# EAGLE board CFT-PB1-revB (EAGLE 5.11)
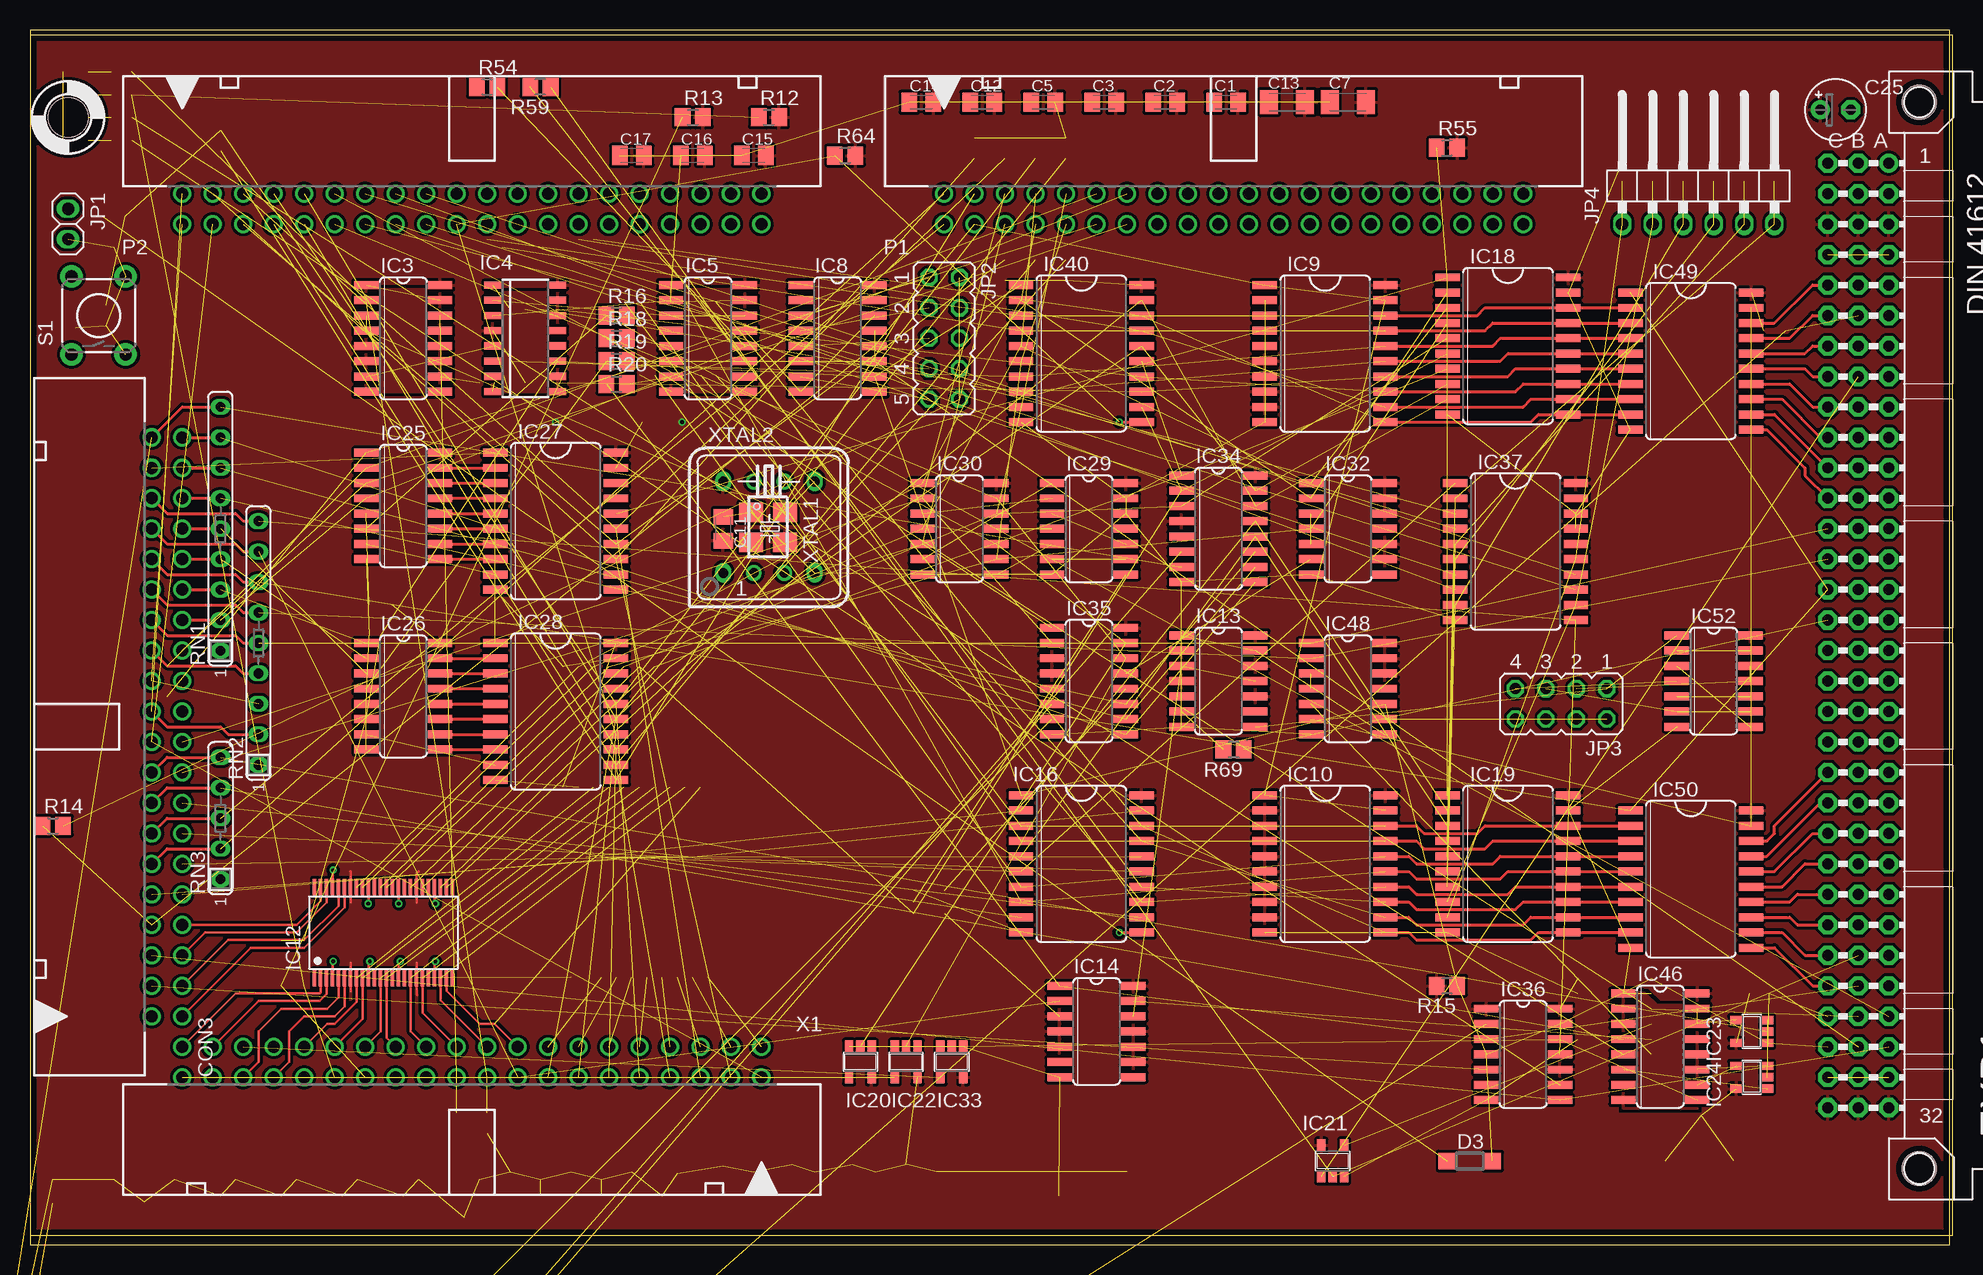
[diagram p11: board, top side]
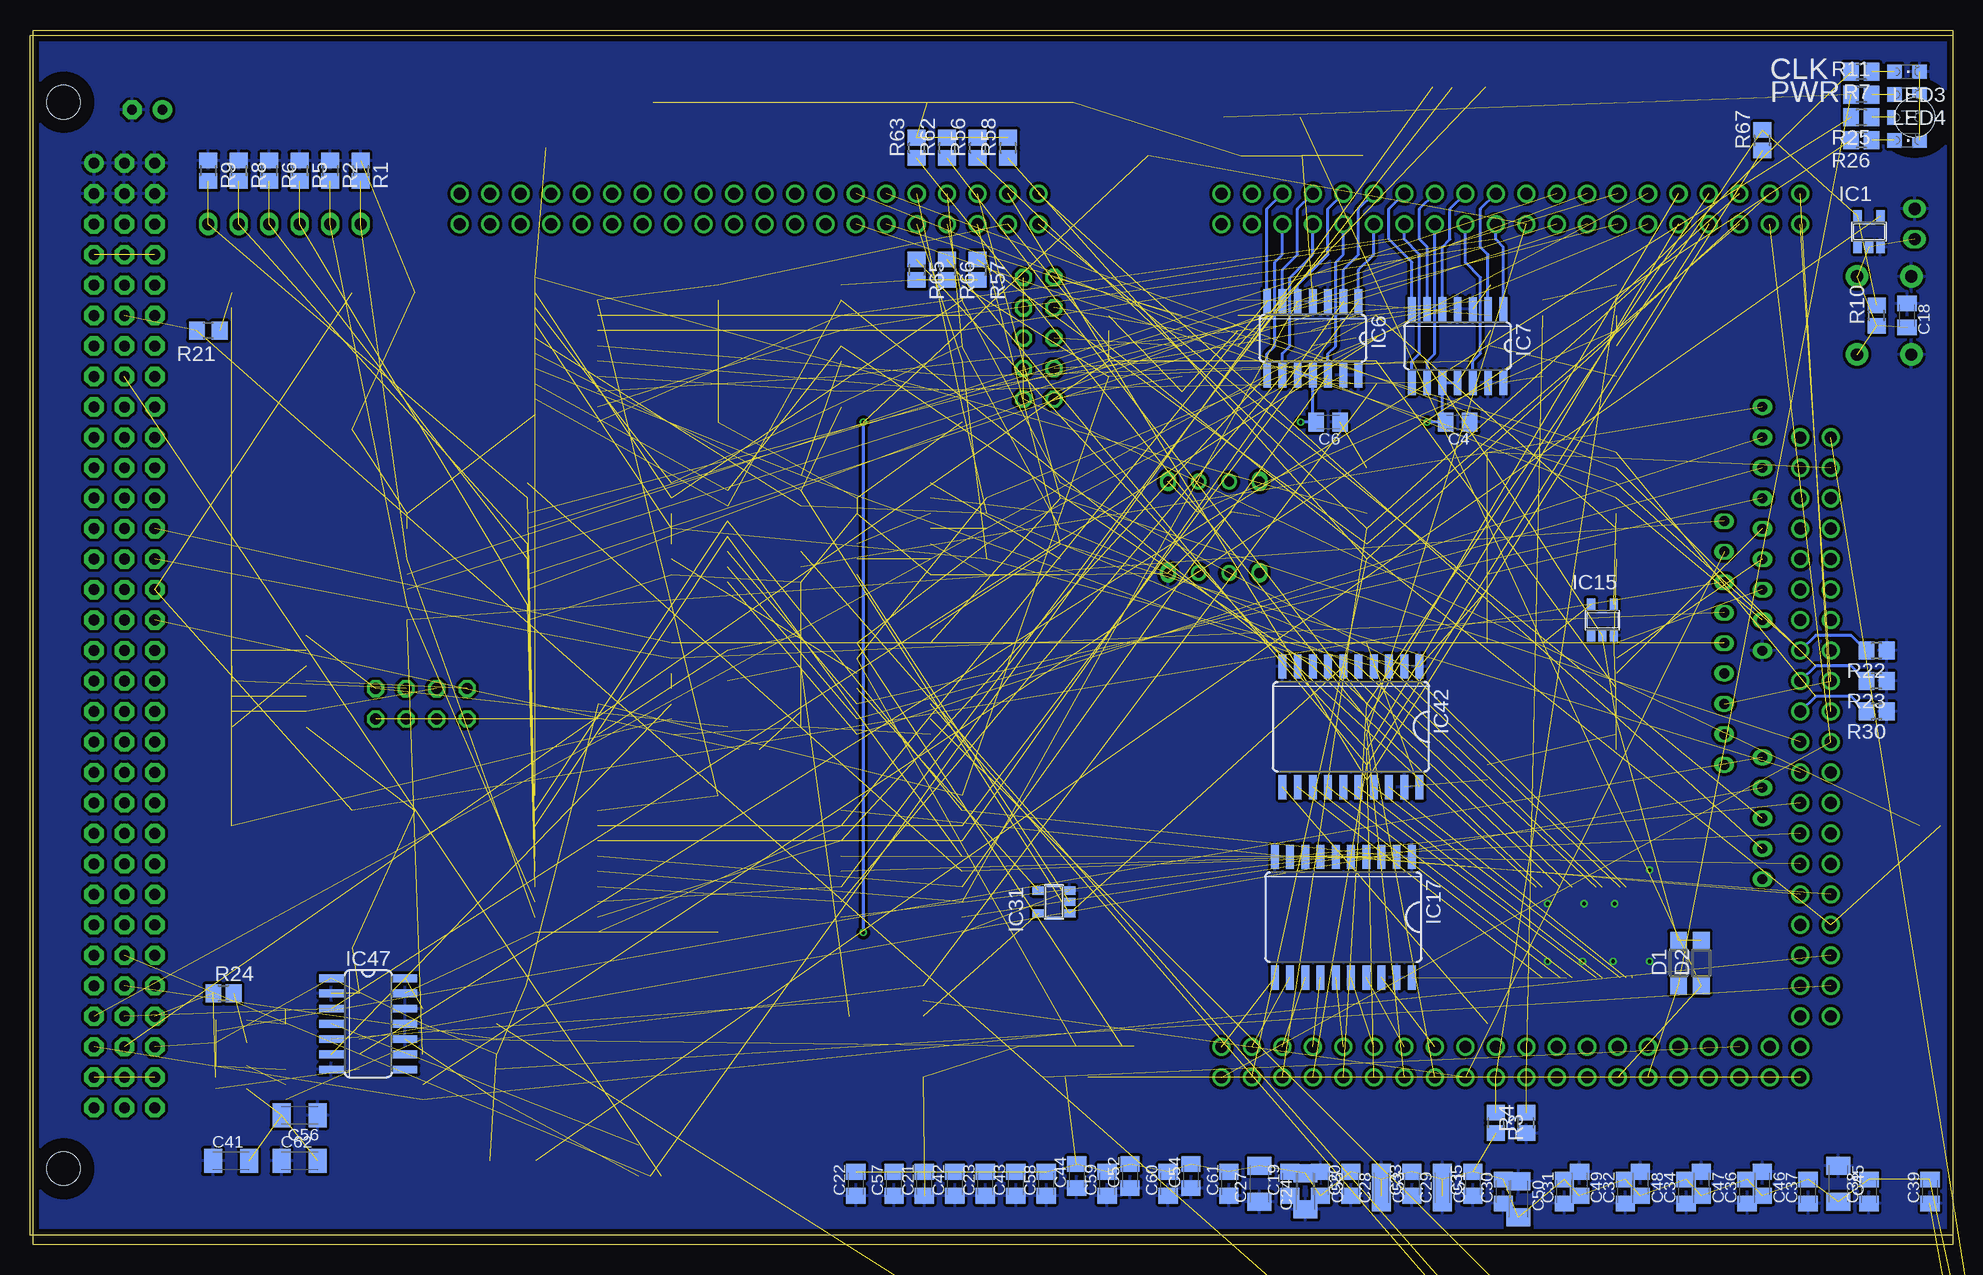
[diagram p12: board, bottom side, seen from below]

Size 160 x 101.27 mm. Coordinates in mm from the lower left corner, seen from the top.
Outline: 0,0 160,0 160,101.27 0,101.27 0,0
Copper layers (1*16): Top 0.035mm / dielectric 1.5mm / Bottom 0.035mm
Design rules "smart-prototyping *": minimum track width 7mil, minimum drill 12mil, track to track 7mil, track to pad 7mil, pad to pad 7mil, via to via 7mil, smd to smd 0mil, copper to edge 20mil, drill to drill 10mil, minimum pad ring 10mil, minimum via ring 6mil, stop-mask expansion 2mil, vias tented up to drill 25mil, thermal gap 10mil
Net classes: 0 default: width 0.152 mm, clearance 0.152 mm; 1 low power: width 0.305 mm, clearance 0.152 mm; 2 LED power: width 0.406 mm, clearance 0.254 mm

## Footprints (pad centres in the part's own frame; a part is rotated, then mirrored left to right if it is on the bottom)
C0805K = smd 1.3 x 1.6: 1 -1,0; 2 1,0
C1206K = smd 1.5 x 2: 1 -1.5,0; 2 1.5,0
E2,5-5 = drill 0.813 pad 1.6 round: + -1.27,0 | drill 0.813 pad 1.6 octagon: - 1.27,0
PAK100/2500-5-40 = drill 1 pad 1.422 round: 1 -24.13,-1.27; 2 -24.13,1.27; 3 -21.59,-1.27; 4 -21.59,1.27; 5 -19.05,-1.27; 6 -19.05,1.27; 7 -16.51,-1.27; 8 -16.51,1.27; 9 -13.97,-1.27; 10 -13.97,1.27; 11 -11.43,-1.27; 12 -11.43,1.27; 13 -8.89,-1.27; 14 -8.89,1.27; 15 -6.35,-1.27; 16 -6.35,1.27; 17 -3.81,-1.27; 18 -3.81,1.27; 19 -1.27,-1.27; 20 -1.27,1.27; 21 1.27,-1.27; 22 1.27,1.27; 23 3.81,-1.27; 24 3.81,1.27; 25 6.35,-1.27; 26 6.35,1.27; 27 8.89,-1.27; 28 8.89,1.27; 29 11.43,-1.27; 30 11.43,1.27; 31 13.97,-1.27; 32 13.97,1.27; 33 16.51,-1.27; 34 16.51,1.27; 35 19.05,-1.27; 36 19.05,1.27; 37 21.59,-1.27; 38 21.59,1.27; 39 24.13,-1.27; 40 24.13,1.27
SOD123 = smd 1.4 x 1.4: A 1.9,0; C -1.9,0
VG96K = drill 0.914 pad 1.6 round: A1 154.94,39.37 | drill 0.914 pad 1.6 octagon: A2 154.94,36.83; A3 154.94,34.29; A4 154.94,31.75; A5 154.94,29.21; A6 154.94,26.67; A7 154.94,24.13; A8 154.94,21.59; A9 154.94,19.05; A10 154.94,16.51; A11 154.94,13.97; A12 154.94,11.43; A13 154.94,8.89; A14 154.94,6.35; A15 154.94,3.81; A16 154.94,1.27; A17 154.94,-1.27; A18 154.94,-3.81; A19 154.94,-6.35; A20 154.94,-8.89; A21 154.94,-11.43; A22 154.94,-13.97; A23 154.94,-16.51; A24 154.94,-19.05; A25 154.94,-21.59; A26 154.94,-24.13; A27 154.94,-26.67; A28 154.94,-29.21; A29 154.94,-31.75; A30 154.94,-34.29; A31 154.94,-36.83; A32 154.94,-39.37; B1 152.4,39.37; B2 152.4,36.83; B3 152.4,34.29; B4 152.4,31.75; B5 152.4,29.21; B6 152.4,26.67; B7 152.4,24.13; B8 152.4,21.59; B9 152.4,19.05; B10 152.4,16.51; B11 152.4,13.97; B12 152.4,11.43; B13 152.4,8.89; B14 152.4,6.35; B15 152.4,3.81; B16 152.4,1.27; B17 152.4,-1.27; B18 152.4,-3.81; B19 152.4,-6.35; B20 152.4,-8.89; B21 152.4,-11.43; B22 152.4,-13.97; B23 152.4,-16.51; B24 152.4,-19.05; B25 152.4,-21.59; B26 152.4,-24.13; B27 152.4,-26.67; B28 152.4,-29.21; B29 152.4,-31.75; B30 152.4,-34.29; B31 152.4,-36.83; B32 152.4,-39.37; C1 149.86,39.37; C2 149.86,36.83; C3 149.86,34.29; C4 149.86,31.75; C5 149.86,29.21; C6 149.86,26.67; C7 149.86,24.13; C8 149.86,21.59; C9 149.86,19.05; C10 149.86,16.51; C11 149.86,13.97; C12 149.86,11.43; C13 149.86,8.89; C14 149.86,6.35; C15 149.86,3.81; C16 149.86,1.27; C17 149.86,-1.27; C18 149.86,-3.81; C19 149.86,-6.35; C20 149.86,-8.89; C21 149.86,-11.43; C22 149.86,-13.97; C23 149.86,-16.51; C24 149.86,-19.05; C25 149.86,-21.59; C26 149.86,-24.13; C27 149.86,-26.67; C28 149.86,-29.21; C29 149.86,-31.75; C30 149.86,-34.29; C31 149.86,-36.83; C32 149.86,-39.37 | hole 2.794: 157.48,44.45; 157.48,-44.45
SOT23-5 = smd 0.69 x 0.99: 1 -0.95,-1.29; 2 0,-1.29; 3 0.95,-1.29; 4 0.95,1.3; 5 -0.95,1.3
SO16 = smd 0.66 x 2.032: 1 -4.445,-3.073; 2 -3.175,-3.073; 3 -1.905,-3.073; 4 -0.635,-3.073; 5 0.635,-3.073; 6 1.905,-3.073; 7 3.175,-3.073; 8 4.445,-3.073; 9 4.445,3.073; 10 3.175,3.073; 11 1.905,3.073; 12 0.635,3.073; 13 -0.635,3.073; 14 -1.905,3.073; 15 -3.175,3.073; 16 -4.445,3.073
SO16D = smd 0.6 x 1.4: 1 -4.445,-2.715; 2 -3.175,-2.715; 3 -1.905,-2.715; 4 -0.635,-2.715; 5 0.635,-2.715; 6 1.905,-2.715; 7 3.175,-2.715; 8 4.445,-2.715; 9 4.445,2.715; 10 3.175,2.715; 11 1.905,2.715; 12 0.635,2.715; 13 -0.635,2.715; 14 -1.905,2.715; 15 -3.175,2.715; 16 -4.445,2.715
SO14 = smd 0.66 x 2.032: 1 -3.81,-3.073; 2 -2.54,-3.073; 3 -1.27,-3.073; 4 0,-3.073; 5 1.27,-3.073; 6 2.54,-3.073; 7 3.81,-3.073; 8 3.81,3.073; 9 2.54,3.073; 10 1.27,3.073; 11 0,3.073; 12 -1.27,3.073; 13 -2.54,3.073; 14 -3.81,3.073
SO20W = smd 0.66 x 2.032: 1 -5.715,-5.029; 2 -4.445,-5.029; 3 -3.175,-5.029; 4 -1.905,-5.029; 5 -0.635,-5.029; 6 0.635,-5.029; 7 1.905,-5.029; 8 3.175,-5.029; 9 4.445,-5.029; 10 5.715,-5.029; 11 5.715,5.029; 12 4.445,5.029; 13 3.175,5.029; 14 1.905,5.029; 15 0.635,5.029; 16 -0.635,5.029; 17 -1.905,5.029; 18 -3.175,5.029; 19 -4.445,5.029; 20 -5.715,5.029
TSSOP-48 = smd 0.28 x 1.43: 1 -5.49,-3.794; 2 -4.99,-3.794; 3 -4.49,-3.794; 4 -3.99,-3.794; 5 -3.49,-3.794; 6 -2.99,-3.794; 7 -2.49,-3.794; 8 -1.99,-3.794; 9 -1.49,-3.794; 10 -0.99,-3.794; 11 -0.49,-3.794; 12 0.01,-3.794; 13 0.51,-3.794; 14 1.01,-3.794; 15 1.51,-3.794; 16 2.01,-3.794; 17 2.51,-3.794; 18 3.01,-3.794; 19 3.51,-3.794; 20 4.01,-3.794; 21 4.51,-3.794; 22 5.01,-3.794; 23 5.51,-3.794; 24 6.01,-3.794; 25 6.01,3.756; 26 5.51,3.756; 27 5.01,3.756; 28 4.51,3.756; 29 4.01,3.756; 30 3.51,3.756; 31 3.01,3.756; 32 2.51,3.756; 33 2.01,3.756; 34 1.51,3.756; 35 1.01,3.756; 36 0.51,3.756; 37 0.01,3.756; 38 -0.49,3.756; 39 -0.99,3.756; 40 -1.49,3.756; 41 -1.99,3.756; 42 -2.49,3.756; 43 -2.99,3.756; 44 -3.49,3.756; 45 -3.99,3.756; 46 -4.49,3.756; 47 -4.99,3.756; 48 -5.49,3.756
DBV_R-PDSO-G6 = smd 0.69 x 0.99: 1 -0.95,-1.29; 2 0,-1.29; 3 0.95,-1.29; 4 0.95,1.3; 5 0,1.3; 6 -0.95,1.3
1X02 = drill 1.016 long: 1 -1.27,0; 2 1.27,0
JP5Q = drill 0.914 octagon: 1 -5.08,-1.27; 2 -5.08,1.27; 3 -2.54,-1.27; 4 -2.54,1.27; 5 0,-1.27; 6 0,1.27; 7 2.54,-1.27; 8 2.54,1.27; 9 5.08,-1.27; 10 5.08,1.27
JP4Q = drill 0.914 octagon: 1 -3.81,-1.27; 2 -3.81,1.27; 3 -1.27,-1.27; 4 -1.27,1.27; 5 1.27,-1.27; 6 1.27,1.27; 7 3.81,-1.27; 8 3.81,1.27
1X06/90 = drill 1.016 long: 1 -6.35,-3.81; 2 -3.81,-3.81; 3 -1.27,-3.81; 4 1.27,-3.81; 5 3.81,-3.81; 6 6.35,-3.81
CHIPLED_0805 = smd 1.2 x 1.2: A 0,-1.05; C 0,1.05
R0805 = smd 1.3 x 1.5: 1 -0.85,0; 2 0.85,0
R0805' = smd 1.3 x 1.5: 1 -0.95,0; 2 0.95,0
SIL9 = drill 0.813 long: 1 -10.16,0; 2 -7.62,0; 3 -5.08,0; 4 -2.54,0; 5 0,0; 6 2.54,0; 7 5.08,0; 8 7.62,0; 9 10.16,0
SIL5 = drill 0.813 long: 1 -5.08,0; 2 -2.54,0; 3 0,0; 4 2.54,0; 5 5.08,0
TACTILE-PTH = drill 1.016 pad 1.88 round: 1 -3.251,2.261; 2 3.251,2.261; 3 -3.251,-2.261; 4 3.251,-2.261
STANDOFF_28_60 = hole 3.302: 0,0
CRYSTAL-SMD-5X3.2MM = smd 1.6 x 2: 1 1.125,-1.475; 2 -1.375,-1.475; 3 -1.375,1.35; 4 1.125,1.35
DIL08S-SOCKET = drill 0.813 long: 1 -3.81,-3.81; 4 3.81,-3.81; 5 3.81,3.81; 8 -3.81,3.81 | drill 0.8 round: 2 -1.27,-3.81; 3 1.27,-3.81; 6 1.27,3.81; 7 -1.27,3.81

## Placement (x,y rotation side)
$4_37_$  SIGNATURESILK  [SIGNATURE]  30.48,-15.88 0 top  (outside the outline)
$4_39_$  OSHW-LOGOL  [OSHW-LOGO-L]  44.45,-10.79 0 top  (outside the outline)
$4_39_$1  OSHW-LOGOL  [OSHW-LOGO-L]  53.34,-10.79 0 top  (outside the outline)
$4_40_$  QRCODE-CFT  [CFT-QRCODE]  3.81,-24.77 0 top  (outside the outline)
C1  0.1uF  [C0805K]  99.69,95.25 0 top
C2  0.1uF  [C0805K]  94.61,95.25 0 top
C3  0.1uF  [C0805K]  89.53,95.25 0 top
C4  0.1uF  [C0805K]  41.27,68.58 180 bottom
C5  0.1uF  [C0805K]  84.45,95.25 0 top
C6  0.1uF  [C0805K]  52.07,68.58 180 bottom
C7  1uF  [C1206K]  109.86,95.25 0 top
C11  0.1uF  [C0805K]  57.78,59.69 270 top
C12  0.1uF  [C0805K]  79.38,95.25 0 top
C13  1uF  [C1206K]  104.78,95.25 0 top
C14  0.1uF  [C0805K]  74.3,95.25 0 top
C15  0.1uF  [C0805K]  60.33,90.8 0 top
C16  0.1uF  [C0805K]  55.24,90.8 0 top
C17  0.1uF  [C0805K]  50.16,90.8 0 top
C18  0.1uF  [C0805K]  3.81,77.47 270 bottom
C19  0.1uF  [C0805K]  55.24,5.08 90 bottom
C20  0.1uF  [C0805K]  50.16,5.08 90 bottom
C21  0.1uF  [C0805K]  85.72,5.08 90 bottom
C22  0.1uF  [C0805K]  91.44,5.08 90 bottom
C23  0.1uF  [C0805K]  80.64,5.08 90 bottom
C24  1uF  [C1206K]  53.98,4.45 90 bottom
C25  1uF  [E2,5-5]  150.5,94.61 0 top
C27  1uF  [C1206K]  57.78,5.08 90 bottom
C28  0.1uF  [C0805K]  47.62,4.45 90 bottom
C29  0.1uF  [C0805K]  42.55,4.45 90 bottom
C30  0.1uF  [C0805K]  37.47,4.45 90 bottom
C31  0.1uF  [C0805K]  32.38,4.45 90 bottom
C32  0.1uF  [C0805K]  27.3,4.45 90 bottom
C33  0.1uF  [C0805K]  45.09,5.08 90 bottom
C34  0.1uF  [C0805K]  22.23,4.45 90 bottom
C35  0.1uF  [C0805K]  40.01,5.08 90 bottom
C36  0.1uF  [C0805K]  17.14,4.45 90 bottom
C37  0.1uF  [C0805K]  12.06,4.45 90 bottom
C38  0.1uF  [C0805K]  6.99,4.45 90 bottom
C39  0.1uF  [C0805K]  1.91,4.45 90 bottom
C41  1uF  [C1206K]  143.51,6.98 0 bottom
C42  0.1uF  [C0805K]  83.19,5.08 90 bottom
C43  0.1uF  [C0805K]  78.11,5.08 90 bottom
C44  0.1uF  [C0805K]  73.03,5.71 90 bottom
C45  1uF  [C1206K]  9.53,5.08 270 bottom
C46  0.1uF  [C0805K]  15.88,5.08 270 bottom
C47  0.1uF  [C0805K]  20.95,5.08 270 bottom
C48  0.1uF  [C0805K]  26.04,5.08 270 bottom
C49  0.1uF  [C0805K]  31.11,5.08 270 bottom
C50  1uF  [C1206K]  36.2,3.81 270 bottom
C51  0.1uF  [C0805K]  42.55,5.08 270 bottom
C52  0.1uF  [C0805K]  68.58,5.71 90 bottom
C53  0.1uF  [C0805K]  47.62,5.08 270 bottom
C54  0.1uF  [C0805K]  63.5,5.71 90 bottom
C55  0.1uF  [C0805K]  52.7,5.08 270 bottom
C56  1uF  [C1206K]  137.79,10.79 180 bottom
C57  0.1uF  [C0805K]  88.27,5.08 90 bottom
C58  0.1uF  [C0805K]  75.56,5.08 90 bottom
C59  0.1uF  [C0805K]  70.48,5.08 90 bottom
C60  0.1uF  [C0805K]  65.41,5.08 90 bottom
C61  0.1uF  [C0805K]  60.33,5.08 90 bottom
C62  1uF  [C1206K]  137.79,6.98 0 bottom
CON3  2540-5  [PAK100/2500-5-40]  11.43,43.18 90 top
D1  [SOD123]  22.86,23.5 90 bottom
D2  [SOD123]  20.95,23.5 90 bottom
D3  [SOD123]  120.02,6.98 0 top
EXP1  [VG96K]  0,50.8 0 top
IC1  74AHC1G14DBV  [SOT23-5]  6.99,84.45 0 bottom
IC2  74AHC1G04DBV  [SOT23-5]  -8.89,-50.16 0 top  (outside the outline)
IC3  74HC253D  [SO16]  31.11,75.56 270 top
IC4  74HC193D  [SO16D]  41.27,75.56 270 top
IC5  74HC139D  [SO16]  56.52,75.56 270 top
IC6  SN74ACT1071D  [SO14]  53.34,75.56 180 bottom
IC7  SN74ACT1071D  [SO14]  41.27,74.93 180 bottom
IC8  74HC590D  [SO16]  67.31,75.56 270 top
IC9  74HC541DW  [SO20W]  107.95,74.3 270 top
IC10  74HC541DW  [SO20W]  107.95,31.75 270 top
IC12  74AC16244DGG  [TSSOP-48]  29.21,26.04 0 top
IC13  74HC74D  [SO14]  99.06,46.99 270 top
IC14  74HC27D  [SO14]  88.9,17.78 270 top
IC15  74AHC1G04DBV  [SOT23-5]  29.21,52.07 0 bottom
IC16  74HC273DW  [SO20W]  87.63,31.75 270 top
IC17  74HC541DW  [SO20W]  50.8,27.3 180 bottom
IC18  74HC541DW  [SO20W]  123.19,74.93 270 top
IC19  74HC541DW  [SO20W]  123.19,31.75 270 top
IC20  74AHC1G125DBV  [SOT23-5]  69.22,15.24 180 top
IC21  74AHC1G32DBV  [SOT23-5]  108.58,6.98 0 top
IC22  74AHC1G125DBV  [SOT23-5]  73.03,15.24 180 top
IC23  74AHC1G08DBV  [SOT23-5]  143.51,17.78 90 top
IC24  74AHC1G32DBV  [SOT23-5]  143.51,13.97 90 top
IC25  74HC138D  [SO16]  31.11,61.6 270 top
IC26  74HC138D  [SO16]  31.11,45.72 270 top
IC27  74HC541DW  [SO20W]  43.81,60.33 270 top
IC28  74HC541DW  [SO20W]  43.81,44.45 270 top
IC29  74HC32D  [SO14]  88.27,59.69 270 top
IC30  74HC08D  [SO14]  77.47,59.69 270 top
IC31  74AHC1G86DBV  [SOT23-5]  74.93,28.57 90 bottom
IC32  74HC32D  [SO14]  109.86,59.69 270 top
IC33  74AHC1G125DBV  [SOT23-5]  76.83,15.24 180 top
IC34  74HC251D  [SO16]  99.06,59.69 270 top
IC35  74HC251D  [SO16]  88.27,46.99 270 top
IC36  74HC74D  [SO14]  124.46,15.88 270 top
IC37  74HC374DW  [SO20W]  123.83,57.79 270 top
IC40  74HC273DW  [SO20W]  87.63,74.3 270 top
IC42  74HC541DW  [SO20W]  50.16,43.18 180 bottom
IC43  74LVC1G11DBV  [DBV_R-PDSO-G6]  -15.24,-68.58 0 top  (outside the outline)
IC46  74HC112D  [SO16]  135.89,16.51 270 top
IC47  74HC74D  [SO14]  132.08,18.41 270 bottom
IC48  74HC08D  [SO14]  109.86,46.36 270 top
IC49  74HC245DW  [SO20W]  138.43,73.66 270 top
IC50  74HC245DW  [SO20W]  138.43,30.48 270 top
IC52  74AC04D  [SO14]  140.34,46.99 270 top
JP1  [1X02]  3.17,85.09 270 top
JP2  [JP5Q]  76.2,75.56 270 top
JP3  [JP4Q]  127.64,45.09 180 top
JP4  [1X06/90]  139.06,88.9 0 top
LED1  LED-5MM-GREEN  [CHIPLED_0805]  3.81,97.79 270 bottom
LED2  LED-5MM-GREEN  [CHIPLED_0805]  3.81,95.88 270 bottom
LED3  LED-5MM-GREEN  [CHIPLED_0805]  3.81,93.98 270 bottom
LED4  LED-5MM-GREEN  [CHIPLED_0805]  3.81,92.08 270 bottom
P1  2540-5  [PAK100/2500-5-40]  100.33,86.36 0 top
P2  2540-5  [PAK100/2500-5-40]  36.83,86.36 0 top
R1  4k7  [R0805]  132.72,89.53 270 bottom
R2  4k7  [R0805]  135.25,89.53 270 bottom
R3  4k7  [R0805]  38.1,10.16 270 bottom
R4  4k7  [R0805]  35.56,10.16 90 bottom
R5  4k7  [R0805]  137.79,89.53 270 bottom
R6  4k7  [R0805]  140.34,89.53 270 bottom
R7  330R  [R0805]  7.62,97.79 180 bottom
R8  4k7  [R0805]  142.88,89.53 270 bottom
R9  4k7  [R0805]  145.41,89.53 270 bottom
R10  50k  [R0805]  6.35,77.47 90 bottom
R11  330R  [R0805]  7.62,95.88 180 bottom
R12  4k7  [R0805]  61.59,93.98 0 top
R13  4k7  [R0805]  55.24,93.98 0 top
R14  30R  [R0805]  1.91,34.93 0 top
R15  4k7  [R0805]  118.11,21.59 180 top
R16  30R  [R0805]  48.9,77.47 0 top
R18  30R  [R0805]  48.9,75.56 0 top
R19  30R  [R0805]  48.9,73.66 0 top
R20  30R  [R0805]  48.9,71.75 0 top
R21  4k7  [R0805']  145.41,76.2 180 bottom
R22  4k7  [R0805]  6.35,49.53 180 bottom
R23  4k7  [R0805]  6.35,46.99 180 bottom
R24  4k7  [R0805]  144.15,20.95 0 bottom
R25  330R  [R0805]  7.62,93.98 180 bottom
R26  330R  [R0805]  7.62,92.08 180 bottom
R30  4k7  [R0805]  6.35,44.45 180 bottom
R54  30R  [R0805]  38.1,96.52 0 top
R55  4k7  [R0805]  118.11,91.44 0 top
R56  4k7  [R0805]  81.28,91.44 90 bottom
R57  4k7  [R0805]  81.28,81.28 270 bottom
R58  4k7  [R0805]  78.74,91.44 90 bottom
R59  30R  [R0805]  42.55,96.52 180 top
R62  4k7  [R0805]  83.82,91.44 90 bottom
R63  4k7  [R0805]  86.36,91.44 90 bottom
R64  4k7  [R0805]  67.94,90.8 0 top
R65  4k7  [R0805]  86.36,81.28 270 bottom
R66  4k7  [R0805]  83.82,81.28 270 bottom
R67  4k7  [R0805]  15.88,92.08 90 bottom
R69  30R  [R0805]  100.33,41.28 180 top
RN1  [SIL9]  15.88,59.69 90 top
RN2  [SIL9]  19.05,50.17 90 top
RN3  [SIL5]  15.88,35.56 90 top
S1  [TACTILE-PTH]  5.71,77.47 90 top
U1  HOLE  [STANDOFF_28_60]  3.17,93.98 0 top
U2  HOLE  [STANDOFF_28_60]  -1.27,-35.56 0 top  (outside the outline)
U3  HOLE  [STANDOFF_28_60]  -8.26,-42.54 0 top  (outside the outline)
U4  HOLE  [STANDOFF_28_60]  -1.27,-42.54 0 top  (outside the outline)
X1  2540-5  [PAK100/2500-5-40]  36.83,15.24 180 top
XTAL1  16.000MHz  [CRYSTAL-SMD-5X3.2MM]  61.59,59.69 270 top
XTAL2  16.000MHz  [DIL08S-SOCKET]  61.59,59.82 0 top

## Tracks (layer width: path | path; a pad name or v marks a point on that pad's centre or on a via)
!BUSEN  (2 unrouted)
!CLI  (1 unrouted)
  Top 0.254: CON3.18 11.43,40.64 RN3.5
!CLL  (1 unrouted)
  Top 0.254: CON3.14 11.43,35.56 RN3.3
!CPL  (1 unrouted)
  Top 0.254: CON3.12 11.43,33.02 RN3.2
!DEC
  Top 0.254: CON3.26 11.43,48.26 17.14,48.26 17.78,47.62 RN2.4
!EN0  (1 unrouted)
!END  (2 unrouted)
  Top 0.254: CON3.36 11.43,60.96 17.14,60.96 17.78,60.33 RN2.9
!FINT  (1 unrouted)
!FPRESET  (2 unrouted)
!INCPC  (2 unrouted)
!IO  (2 unrouted)
  Top 0.254: CON3.30 11.43,53.34 17.14,53.34 17.78,52.71 RN2.6
!IRQ  (2 unrouted)
!IRQS  (2 unrouted)
!MASKEDIRQ  (1 unrouted)
!MEM  (2 unrouted)
  Top 0.254: CON3.28 11.43,50.8 17.14,50.8 17.78,50.17 RN2.5
!OPIF3  (1 unrouted)
!R  (3 unrouted)
  Top 0.254: CON3.32 11.43,55.88 17.14,55.88 17.78,55.25 RN2.7
!RAC  (3 unrouted)
!RAGL  (3 unrouted)
!RDR  (2 unrouted)
!RESET  (15 unrouted)
!RESET_OR_CLI  (2 unrouted)
!RPC  (3 unrouted)
!RSTHOLD  (7 unrouted)
!RUEN  (1 unrouted)
!SKIP  (1 unrouted)
!SKIP0  (1 unrouted)
!SKIPEXT  (2 unrouted)
!STI  (1 unrouted)
  Top 0.254: CON3.16 11.43,38.1 RN3.4
!STPAC  (2 unrouted)
!STPDR  (1 unrouted)
  Top 0.254: CON3.22 11.43,43.18 15.88,43.18 16.51,42.55 RN2.2
!T34  (2 unrouted)
!UCE  (2 unrouted)
!W  (1 unrouted)
!WAC  (3 unrouted)
!WAITING  (1 unrouted)
!WALU  (2 unrouted)
!WAR  (3 unrouted)
!WCLR  (2 unrouted)
!WDR  (3 unrouted)
!WEN  (2 unrouted)
  Top 0.254: CON3.34 11.43,58.42 17.14,58.42 17.78,57.79 RN2.8
!WIR  (via drill 0.3)  (4 unrouted)
  Top 0.254: v90.81,68.58 IC40.11 | v90.81,26.04 IC16.11
  Bottom 0.254: v90.81,26.04 v90.81,68.58
!WPC  (3 unrouted)
!WS  (1 unrouted)
+3.3V  (2 unrouted)
+12V  (2 unrouted)
BFIRQ  (1 unrouted)
BFNEG  (1 unrouted)
BFZERO  (1 unrouted)
CLK1  (2 unrouted)
CLK2  (2 unrouted)
CLK3  (4 unrouted)
CLK4  (3 unrouted)
DB0
  Top 0.254: EXP1.C5 148.59,80.01 145.41,76.83 IC49.18
DB1
  Top 0.254: EXP1.C6 148.59,77.47 146.69,75.56 IC49.17
DB2
  Top 0.254: EXP1.C7 148.59,74.93 147.96,74.3 IC49.16
DB3
  Top 0.254: EXP1.C8 148.59,72.39 147.96,73.02 IC49.15
DB4
  Top 0.254: EXP1.C9 148.59,69.85 146.69,71.75 IC49.14
DB5
  Top 0.254: EXP1.C10 149.22,67.31 146.05,70.48 IC49.13
DB6
  Top 0.254: EXP1.C11 145.41,69.21 IC49.12
DB7
  Top 0.254: EXP1.C12 147.96,64.14 147.96,64.77 144.78,67.94 IC49.11
DB8
  Top 0.254: IC50.18 144.78,33.66 145.41,34.29 145.41,34.93 EXP1.C21
DB9
  Top 0.254: IC50.17 144.78,32.38 149.22,36.83 EXP1.C22
DB10
  Top 0.254: IC50.16 145.41,31.11 148.59,34.29 EXP1.C23
DB11
  Top 0.254: IC50.15 146.05,29.84 147.96,31.75 EXP1.C24
DB12
  Top 0.254: IC50.14 146.69,28.57 147.32,29.21 EXP1.C25
DB13
  Top 0.254: IC50.13 146.69,27.3 147.32,26.67 EXP1.C26
DB14
  Top 0.254: IC50.12 146.05,26.04 147.96,24.13 EXP1.C27
DB15
  Top 0.254: IC50.11 145.41,24.77 148.59,21.59 EXP1.C28
FASTCLK  (3 unrouted)
FINT  (1 unrouted)
FIRQ  (2 unrouted)
FL  (3 unrouted)
FNEG  (3 unrouted)
FPCLKEN  (3 unrouted)
FPIR0  (1 unrouted)
  Top 0.203: IC12.8 27.22,20.23 25.4,18.41 24.77,18.41 X1.31
FPIR1  (1 unrouted)
  Top 0.203: IC12.9 27.72,18.83 X1.29
FPIR2  (1 unrouted)
  Top 0.203: IC12.12 29.22,17.79 X1.27
FPIR3  (1 unrouted)
  Top 0.203: IC12.13 29.72,17.27 X1.25
FPIR4  (1 unrouted)
  Top 0.203: IC12.17 31.72,17.81 X1.23
FPIR5  (1 unrouted)
  Top 0.203: IC12.19 32.72,19.35 X1.21
FPIR6  (1 unrouted)
  Top 0.203: IC12.22 34.22,20.39 X1.19
FPIR7  (1 unrouted)
  Top 0.203: IC12.23 34.72,21.16 37.47,18.41 38.73,18.41 X1.17
FPIR8  (1 unrouted)
FPIR9  (1 unrouted)
FPIR10  (1 unrouted)
FPIR11  (1 unrouted)
FPIR12  (1 unrouted)
FPIR13  (1 unrouted)
FPIR14  (1 unrouted)
FPIR15  (1 unrouted)
FPUPC0
  Top 0.203: IC12.6 26.22,19.87 25.4,19.05 22.86,19.05 21.59,17.78 21.59,15.24 X1.34
FPUPC1
  Top 0.203: IC12.5 25.72,20.64 24.77,19.68 20.95,19.68 19.05,17.78 19.05,15.24 X1.36
FPUPC2
  Top 0.203: IC12.3 24.72,20.91 24.13,20.32 19.05,20.32 X1.37
FPUPC3
  Top 0.203: IC12.2 24.22,21.04 24.13,20.95 17.14,20.95 X1.39
FPUSTEP  (2 unrouted)
FV  (3 unrouted)
FZERO  (3 unrouted)
GND  (via drill 0.3)  (74 unrouted)
  Top 0.203: IC12.45 25.22,31.19 v25.27,31.24 | IC12.34 30.72,28.46 v30.73,28.45 | IC12.28 33.72,28.51 v33.78,28.45 | IC12.10 28.22,23.52 v28.32,23.62 | IC12.21 33.72,23.56 v33.78,23.62 | IC12.15 30.72,23.48 v30.86,23.62 | IC12.4 25.22,23.57 v25.27,23.62 | IC12.39 28.22,28.47 v28.19,28.45
  pour Bottom (isolate 0.254, rank 6): 0,101.6 160.66,101.6 160.66,0.64 0,0.64
  pour Top (isolate 0.254, rank 3): 38.1,79.38 38.1,71.12 44.45,71.12 44.45,79.38
  pour Top (isolate 0.254, rank 3): 53.34,79.63 53.34,71.12 59.69,71.12 59.69,79.63
  pour Top (isolate 0.254, rank 3): 27.94,79.63 27.94,71.12 34.29,71.12 34.29,79.63
  pour Top (isolate 0.254, rank 3): 132.72,21.21 132.72,11.43 139.06,11.43 139.06,19.94 135.64,19.94 134.62,20.95
IBUS0  (2 unrouted)
  Top 0.254: IC49.2 IC18.18 121.28,78.1 120.65,77.47 IC9.18
  Bottom 0.254: P2.21 38.1,83.82 37.47,83.19 IC7.1
IBUS1  (2 unrouted)
  Top 0.254: IC49.3 IC18.17 121.92,76.83 121.28,76.2 IC9.17
  Bottom 0.254: P2.22 39.37,86.36 39.37,83.19 38.73,82.55 IC7.2
IBUS2  (2 unrouted)
  Top 0.254: IC49.4 IC18.16 122.56,75.56 121.92,74.93 IC9.16
  Bottom 0.254: P2.23 40.64,81.91 39.37,80.64 39.37,74.3 40.01,73.66 IC7.12
IBUS3  (2 unrouted)
  Top 0.254: IC49.5 IC18.15 123.19,74.3 122.56,73.66 IC9.15
  Bottom 0.254: P2.24 41.91,86.36 41.91,83.82 42.55,83.19 IC7.5
IBUS4  (2 unrouted)
  Top 0.254: IC49.6 IC18.14 123.83,73.02 123.19,72.39 IC9.14
  Bottom 0.254: P2.25 43.18,74.3 43.81,73.66 IC7.9
IBUS5  (2 unrouted)
  Top 0.254: IC49.7 IC18.13 124.46,71.75 123.83,71.12 IC9.13
  Bottom 0.254: P2.26 44.45,86.36 44.45,83.82 43.81,83.19 IC7.6
IBUS6  (2 unrouted)
  Top 0.254: IC49.8 IC18.12 125.09,70.48 124.46,69.85 IC9.12
  Bottom 0.254: P2.27 45.72,83.82 44.45,82.55 44.45,74.3 45.09,73.66 IC7.8
IBUS7  (2 unrouted)
  Top 0.254: IC49.9 IC18.11 125.73,69.21 125.09,68.58 IC9.11
  Bottom 0.254: P2.28 46.99,86.36 46.99,83.82 45.09,81.91 IC7.7
IBUS8  (2 unrouted)
  Top 0.254: IC10.18 115.57,34.93 116.2,34.29 120.65,34.29 121.28,34.93 IC19.18 IC50.2
  Bottom 0.254: P2.29 48.26,82.55 49.53,81.28 IC6.1
IBUS9  (2 unrouted)
  Top 0.254: IC10.17 115.57,33.66 116.2,33.02 121.28,33.02 121.92,33.66 IC19.17 IC50.3
  Bottom 0.254: P2.30 49.53,86.36 49.53,82.55 50.8,81.28 IC6.2
IBUS10  (2 unrouted)
  Top 0.254: IC10.16 114.94,32.38 115.57,31.75 121.92,31.75 122.56,32.38 IC19.16 IC50.4
  Bottom 0.254: P2.31 50.8,82.55 51.44,81.91 51.44,74.93 52.07,74.3 IC6.12
IBUS11  (2 unrouted)
  Top 0.254: IC10.15 114.94,31.11 115.57,30.48 122.56,30.48 123.19,31.11 IC19.15 IC50.5
  Bottom 0.254: P2.32 52.07,86.36 52.07,82.55 54.61,80.01 IC6.5
IBUS12  (2 unrouted)
  Top 0.254: IC10.14 114.94,29.84 115.57,29.21 123.19,29.21 123.83,29.84 IC19.14 IC50.6
  Bottom 0.254: P2.33 53.34,82.55 55.24,80.64 55.24,74.93 55.88,74.3 IC6.9
IBUS13  (2 unrouted)
  Top 0.254: IC10.13 114.94,28.57 115.57,27.94 123.83,27.94 124.46,28.57 IC19.13 IC50.7
  Bottom 0.254: P2.34 54.61,86.36 54.61,82.55 55.88,81.28 IC6.6
IBUS14  (2 unrouted)
  Top 0.254: IC10.12 114.94,27.3 115.57,26.67 124.46,26.67 125.09,27.3 IC19.12 IC50.8
  Bottom 0.254: P2.35 55.88,82.55 56.52,81.91 56.52,74.93 57.15,74.3 IC6.8
IBUS15  (2 unrouted)
  Top 0.254: IC10.11 114.94,26.04 115.57,25.4 125.09,25.4 125.73,26.04 IC19.11 IC50.9
  Bottom 0.254: P2.36 57.15,86.36 IC6.7
IR0  (6 unrouted)
IR1  (6 unrouted)
IR2  (6 unrouted)
IR3  (6 unrouted)
IR4  (5 unrouted)
IR5  (4 unrouted)
IR6  (4 unrouted)
IR7  (4 unrouted)
IR8  (3 unrouted)
IR9  (3 unrouted)
IR10  (2 unrouted)
IR11  (2 unrouted)
IR12  (2 unrouted)
IR13  (2 unrouted)
IR14  (2 unrouted)
IR15  (2 unrouted)
N$1  (2 unrouted)
N$2  (1 unrouted)
N$3  (1 unrouted)
N$4  (1 unrouted)
N$6  (1 unrouted)
N$7  (1 unrouted)
N$8  (1 unrouted)
N$9  (1 unrouted)
N$10  (5 unrouted)
N$15  (2 unrouted)
N$16  (1 unrouted)
N$17  (1 unrouted)
N$18  (2 unrouted)
N$19  (1 unrouted)
N$20  (1 unrouted)
N$21  (1 unrouted)
N$22  (1 unrouted)
N$23  (1 unrouted)
N$24  (4 unrouted)
N$25  (2 unrouted)
N$33  (5 unrouted)
N$36  (1 unrouted)
N$154  (1 unrouted)
N$347  (1 unrouted)
N$375  (1 unrouted)
N$376  (1 unrouted)
N$377  (1 unrouted)
N$418  (1 unrouted)
N$458  (1 unrouted)
N$459
  Top 0.254: IC25.9 IC27.8
N$460
  Top 0.254: IC25.10 IC27.7
N$461
  Top 0.254: IC25.11 IC27.6
N$463
  Top 0.254: IC25.12 IC27.5
N$464
  Top 0.254: IC25.13 IC27.4
N$465
  Top 0.254: IC25.14 IC27.3
N$466
  Top 0.254: IC25.15 IC27.2
N$483
  Top 0.254: IC26.15 IC28.2
N$484
  Top 0.254: IC26.14 IC28.3
N$485
  Top 0.254: IC26.13 IC28.4
N$486
  Top 0.254: IC26.12 IC28.5
N$487
  Top 0.254: IC26.11 IC28.6
N$488
  Top 0.254: IC26.10 IC28.7
N$505
  Top 0.254: IC26.9 IC28.8
N$506  (1 unrouted)
N$732  (1 unrouted)
N$733  (1 unrouted)
N$739  (1 unrouted)
OP1_BRANCH  (1 unrouted)
OP2_ROLL  (1 unrouted)
OPIF0  (2 unrouted)
  Top 0.254: CON3.35 RN1.6
OPIF1  (2 unrouted)
  Top 0.254: CON3.37 RN1.7
OPIF2  (2 unrouted)
  Top 0.254: CON3.39 RN1.8
OPIF3  (2 unrouted)
  Top 0.254: CON3.40 12.7,69.85 RN1.9
PAGE0  (3 unrouted)
PAGE1  (3 unrouted)
PAGE2  (3 unrouted)
PAGE3  (3 unrouted)
PAGE4  (3 unrouted)
PAGE5  (3 unrouted)
PC10  (1 unrouted)
PC11  (1 unrouted)
PC12  (1 unrouted)
PC13  (1 unrouted)
PC14  (1 unrouted)
PC15  (1 unrouted)
POWERLED  (1 unrouted)
POWEROK  (3 unrouted)
RUNIT0  (2 unrouted)
  Bottom 0.254: CON3.21 11.43,45.72 8.47,45.72 R30.2
RUNIT1  (2 unrouted)
  Bottom 0.254: CON3.23 11.43,48.26 8.47,48.26 R23.2
RUNIT2  (2 unrouted)
  Bottom 0.254: CON3.25 11.43,50.8 8.47,50.8 R22.2
RUNIT3  (2 unrouted)
  Top 0.254: CON3.27 RN1.2
SKIPMUXHI  (1 unrouted)
SKIPMUXLO  (1 unrouted)
SL  (1 unrouted)
SN  (1 unrouted)
SV  (1 unrouted)
SVL  (1 unrouted)
SVLZN  (1 unrouted)
SZ  (1 unrouted)
SZN  (1 unrouted)
UPC0
  Top 0.203: CON3.1 18.41,24.77 22.86,24.77 26.22,28.12 IC12.43
UPC1
  Top 0.203: CON3.3 16.51,25.4 22.86,25.4 25.72,28.26 IC12.44
UPC2
  Top 0.203: IC12.46 24.72,28.53 22.23,26.04 14.61,26.04 CON3.5
UPC3
  Top 0.203: CON3.7 22.23,26.67 24.22,28.66 IC12.47
VCC  (via drill 0.3)  (62 unrouted)
  Top 0.203: 32.26,20.83 32.22,20.87 IC12.18 32.22,23.51 | 26.72,21.13 IC12.7 | 26.72,23.51 26.72,22.4 | 26.67,31.11 26.72,31.11 IC12.42 26.72,28.52 | IC12.31 32.22,30.95 32.38,31.11 | 32.22,28.52 32.22,29.68
  Bottom 0.254: IC6.10 IC6.11 53.34,68.85 C6.2 v54.36,68.58 | 42.55,68.85 IC7.10 IC7.11 | C4.2 42.55,68.85 | 42.55,68.85 42.81,68.58 v43.81,68.58
  pour Top (isolate 0.254, rank 6): 0,101.6 160.66,101.6 160.66,0.64 0,0.64
WAITING  (1 unrouted)
WUNIT0  (1 unrouted)
  Top 0.254: CON3.29 RN1.3
WUNIT1  (1 unrouted)
  Top 0.254: CON3.31 RN1.4
WUNIT2  (1 unrouted)
  Top 0.254: CON3.33 RN1.5
÷2  (1 unrouted)
÷4  (2 unrouted)

## Text on the board
bNames: CLK | PWR